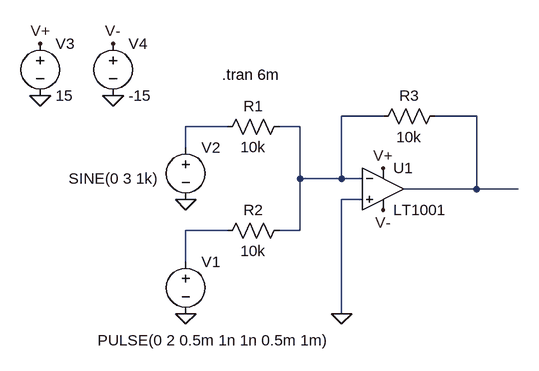
[diagram p0: schematic Summain.asc]
Summain.asc, the LTspice schematic file:
Version 4
SHEET 1 880 680
WIRE 368 64 304 64
WIRE 512 64 448 64
WIRE 128 80 64 80
WIRE 240 80 208 80
WIRE 64 112 64 80
WIRE 240 160 240 80
WIRE 304 160 304 64
WIRE 304 160 240 160
WIRE 336 160 304 160
WIRE 512 176 512 64
WIRE 512 176 400 176
WIRE 576 176 512 176
WIRE 336 192 304 192
WIRE 128 240 64 240
WIRE 240 240 240 160
WIRE 240 240 208 240
WIRE 64 288 64 240
WIRE 304 368 304 192
FLAG 304 368 0
FLAG 64 368 0
FLAG -48 32 0
FLAG -160 32 0
FLAG 64 192 0
FLAG 368 144 V+
FLAG -160 -48 V+
FLAG -48 -48 V-
FLAG 368 208 V-
SYMBOL Opamps\\LT1001 368 112 R0
SYMATTR InstName U1
SYMBOL voltage 64 272 R0
WINDOW 3 -136 137 Left 2
WINDOW 123 0 0 Left 2
WINDOW 39 0 0 Left 2
SYMATTR InstName V1
SYMATTR Value PULSE(0 2 0.5m 1n 1n 0.5m 1m)
SYMBOL voltage 64 96 R0
WINDOW 3 -180 64 Left 2
WINDOW 123 0 0 Left 2
WINDOW 39 0 0 Left 2
SYMATTR InstName V2
SYMATTR Value SINE(0 3 1k)
SYMBOL voltage -160 -64 R0
WINDOW 123 0 0 Left 2
WINDOW 39 0 0 Left 2
SYMATTR InstName V3
SYMATTR Value 15
SYMBOL voltage -48 -64 R0
WINDOW 123 0 0 Left 2
WINDOW 39 0 0 Left 2
SYMATTR InstName V4
SYMATTR Value -15
SYMBOL res 224 64 R90
WINDOW 0 0 56 VBottom 2
WINDOW 3 32 56 VTop 2
SYMATTR InstName R1
SYMATTR Value 10k
SYMBOL res 224 224 R90
WINDOW 0 0 56 VBottom 2
WINDOW 3 32 56 VTop 2
SYMATTR InstName R2
SYMATTR Value 10k
SYMBOL res 464 48 R90
WINDOW 0 0 56 VBottom 2
WINDOW 3 32 56 VTop 2
SYMATTR InstName R3
SYMATTR Value 10k
TEXT 120 0 Left 2 !.tran 6m

The netlist it stands for:
* Summain.asc
XU1 0 N001 V+ V- N002 LT1001  ; pins In+ In- V+ V- OUT
V1 N004 0 PULSE(0 2 0.5m 1n 1n 0.5m 1m)
V2 N003 0 SINE(0 3 1k)
V3 V+ 0 15
V4 V- 0 -15
R1 N001 N003 10k
R2 N001 N004 10k
R3 N002 N001 10k
.tran 6m
.lib LTC.lib
.backanno
.end